# EAGLE board v7-flex2811_32x (EAGLE 7.3.0)
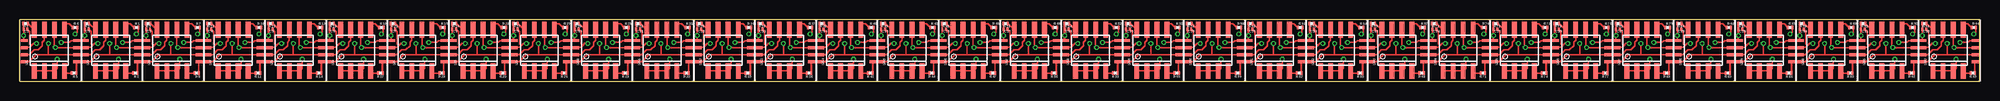
[diagram p32: board, top side]
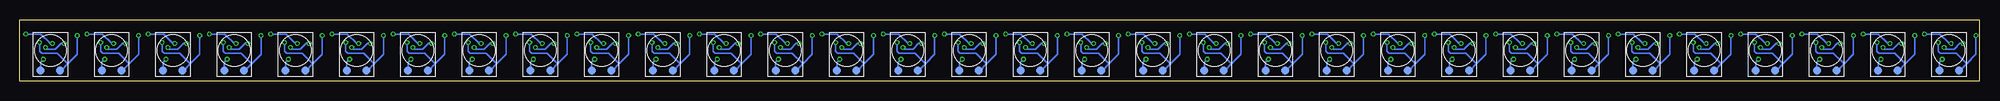
[diagram p33: board, bottom side, seen from below]

Size 248 x 7.75 mm. Coordinates in mm from the lower left corner, seen from the top.
Outline: 0,0 248,0 248,7.75 0,7.75 0,0
Copper layers (1*16): Top 0.035mm / dielectric 1.5mm / Bottom 0.035mm
Design rules "PCBWayMin": minimum track width 6mil, minimum drill 0.3mm, track to track 6mil, track to pad 6mil, pad to pad 6mil, via to via 6mil, smd to smd 0mil, copper to edge 10mil, drill to drill 8mil, minimum pad ring 10mil, minimum via ring 6mil, stop-mask expansion 4mil, vias tented up to drill 25mil, thermal gap 10mil

## Footprints (pad centres in the part's own frame; a part is rotated, then mirrored left to right if it is on the bottom)
C0201 = smd 0.25 x 0.35: 1 -0.25,0; 2 0.25,0
R0201 = smd 0.28 x 0.43: 1 -0.255,0; 2 0.255,0
SO08 = smd 0.6 x 2: 1 -1.905,-2.6; 2 -0.635,-2.6; 3 0.635,-2.6; 4 1.905,-2.6; 5 1.905,2.6; 6 0.635,2.6; 7 -0.635,2.6; 8 -1.905,2.6
TP_4MM_MED_PAD = smd 1.016 x 1.016: P$1 -1.24,-2.55; P$2 1.24,-2.55
4PAD = smd 1 x 0.4: P$1 0,0.3 | smd 1 x 0.35: P$2 0,1.2; P$3 0,2.1; P$4 0,3

## Placement (x,y rotation side)
C1  [C0201]  8.47,6.55 0 top
C2  [C0201]  0.72,6.55 0 top
C3  [C0201]  16.23,6.55 0 top
C4  [C0201]  23.98,6.55 0 top
C5  [C0201]  31.73,6.55 0 top
C6  [C0201]  39.48,6.55 0 top
C7  [C0201]  47.23,6.55 0 top
C8  [C0201]  54.98,6.55 0 top
C9  [C0201]  62.73,6.55 0 top
C10  [C0201]  70.47,6.55 0 top
C11  [C0201]  78.22,6.55 0 top
C12  [C0201]  85.97,6.55 0 top
C13  [C0201]  93.72,6.55 0 top
C14  [C0201]  101.47,6.55 0 top
C15  [C0201]  109.22,6.55 0 top
C16  [C0201]  116.97,6.55 0 top
C17  [C0201]  124.72,6.55 0 top
C18  [C0201]  132.47,6.55 0 top
C19  [C0201]  140.22,6.55 0 top
C20  [C0201]  147.97,6.55 0 top
C21  [C0201]  155.72,6.55 0 top
C22  [C0201]  163.47,6.55 0 top
C23  [C0201]  171.22,6.55 0 top
C24  [C0201]  178.97,6.55 0 top
C25  [C0201]  186.72,6.55 0 top
C26  [C0201]  194.47,6.55 0 top
C27  [C0201]  202.22,6.55 0 top
C28  [C0201]  209.97,6.55 0 top
C29  [C0201]  217.72,6.55 0 top
C30  [C0201]  225.47,6.55 0 top
C31  [C0201]  233.22,6.55 0 top
C32  [C0201]  240.97,6.55 0 top
R1  [R0201]  14.75,6.75 0 top
R2  [R0201]  14.62,1 180 top
R3  100  [R0201]  8.47,7.28 180 top
R4  [R0201]  7,6.75 0 top
R5  [R0201]  6.88,1 180 top
R6  100  [R0201]  0.72,7.28 180 top
R7  [R0201]  22.5,6.75 0 top
R8  [R0201]  22.38,1 180 top
R9  100  [R0201]  16.23,7.28 180 top
R10  [R0201]  30.25,6.75 0 top
R11  [R0201]  30.12,1 180 top
R12  100  [R0201]  23.98,7.28 180 top
R13  [R0201]  38,6.75 0 top
R14  [R0201]  37.88,1 180 top
R15  100  [R0201]  31.73,7.28 180 top
R16  [R0201]  45.75,6.75 0 top
R17  [R0201]  45.62,1 180 top
R18  100  [R0201]  39.48,7.28 180 top
R19  [R0201]  53.5,6.75 0 top
R20  [R0201]  53.38,1 180 top
R21  100  [R0201]  47.23,7.28 180 top
R22  [R0201]  61.25,6.75 0 top
R23  [R0201]  61.12,1 180 top
R24  100  [R0201]  54.98,7.28 180 top
R25  [R0201]  69,6.75 0 top
R26  [R0201]  68.88,1 180 top
R27  100  [R0201]  62.73,7.28 180 top
R28  [R0201]  76.75,6.75 0 top
R29  [R0201]  76.62,1 180 top
R30  100  [R0201]  70.47,7.28 180 top
R31  [R0201]  84.5,6.75 0 top
R32  [R0201]  84.38,1 180 top
R33  100  [R0201]  78.22,7.28 180 top
R34  [R0201]  92.25,6.75 0 top
R35  [R0201]  92.12,1 180 top
R36  100  [R0201]  85.97,7.28 180 top
R37  [R0201]  100,6.75 0 top
R38  [R0201]  99.88,1 180 top
R39  100  [R0201]  93.72,7.28 180 top
R40  [R0201]  107.75,6.75 0 top
R41  [R0201]  107.62,1 180 top
R42  100  [R0201]  101.47,7.28 180 top
R43  [R0201]  115.5,6.75 0 top
R44  [R0201]  115.38,1 180 top
R45  100  [R0201]  109.22,7.28 180 top
R46  [R0201]  123.25,6.75 0 top
R47  [R0201]  123.12,1 180 top
R48  100  [R0201]  116.97,7.28 180 top
R49  [R0201]  131,6.75 0 top
R50  [R0201]  130.88,1 180 top
R51  100  [R0201]  124.72,7.28 180 top
R52  [R0201]  138.75,6.75 0 top
R53  [R0201]  138.62,1 180 top
R54  100  [R0201]  132.47,7.28 180 top
R55  [R0201]  146.5,6.75 0 top
R56  [R0201]  146.38,1 180 top
R57  100  [R0201]  140.22,7.28 180 top
R58  [R0201]  154.25,6.75 0 top
R59  [R0201]  154.12,1 180 top
R60  100  [R0201]  147.97,7.28 180 top
R61  [R0201]  162,6.75 0 top
R62  [R0201]  161.88,1 180 top
R63  100  [R0201]  155.72,7.28 180 top
R64  [R0201]  169.75,6.75 0 top
R65  [R0201]  169.62,1 180 top
R66  100  [R0201]  163.47,7.28 180 top
R67  [R0201]  177.5,6.75 0 top
R68  [R0201]  177.38,1 180 top
R69  100  [R0201]  171.22,7.28 180 top
R70  [R0201]  185.25,6.75 0 top
R71  [R0201]  185.12,1 180 top
R72  100  [R0201]  178.97,7.28 180 top
R73  [R0201]  193,6.75 0 top
R74  [R0201]  192.88,1 180 top
R75  100  [R0201]  186.72,7.28 180 top
R76  [R0201]  200.75,6.75 0 top
R77  [R0201]  200.62,1 180 top
R78  100  [R0201]  194.47,7.28 180 top
R79  [R0201]  208.5,6.75 0 top
R80  [R0201]  208.38,1 180 top
R81  100  [R0201]  202.22,7.28 180 top
R82  [R0201]  216.25,6.75 0 top
R83  [R0201]  216.12,1 180 top
R84  100  [R0201]  209.97,7.28 180 top
R85  [R0201]  224,6.75 0 top
R86  [R0201]  223.88,1 180 top
R87  100  [R0201]  217.72,7.28 180 top
R88  [R0201]  231.75,6.75 0 top
R89  [R0201]  231.62,1 180 top
R90  100  [R0201]  225.47,7.28 180 top
R91  [R0201]  239.5,6.75 0 top
R92  [R0201]  239.38,1 180 top
R93  100  [R0201]  233.22,7.28 180 top
R94  [R0201]  247.25,6.75 0 top
R95  [R0201]  247.12,1 180 top
R96  100  [R0201]  240.97,7.28 180 top
U1  WS2818  [SO08]  3.75,3.88 0 top
U2  WS2818  [SO08]  11.5,3.88 0 top
U3  WS2818  [SO08]  19.25,3.88 0 top
U4  WS2818  [SO08]  27,3.88 0 top
U5  WS2818  [SO08]  34.75,3.88 0 top
U6  WS2818  [SO08]  42.5,3.88 0 top
U7  WS2818  [SO08]  50.25,3.88 0 top
U8  WS2818  [SO08]  58,3.88 0 top
U9  WS2818  [SO08]  65.75,3.88 0 top
U10  WS2818  [SO08]  73.5,3.88 0 top
U11  WS2818  [SO08]  81.25,3.88 0 top
U12  WS2818  [SO08]  89,3.88 0 top
U13  WS2818  [SO08]  96.75,3.88 0 top
U14  WS2818  [SO08]  104.5,3.88 0 top
U15  WS2818  [SO08]  112.25,3.88 0 top
U16  WS2818  [SO08]  120,3.88 0 top
U17  WS2818  [SO08]  127.75,3.88 0 top
U18  WS2818  [SO08]  135.5,3.88 0 top
U19  WS2818  [SO08]  143.25,3.88 0 top
U20  WS2818  [SO08]  151,3.88 0 top
U21  WS2818  [SO08]  158.75,3.88 0 top
U22  WS2818  [SO08]  166.5,3.88 0 top
U23  WS2818  [SO08]  174.25,3.88 0 top
U24  WS2818  [SO08]  182,3.88 0 top
U25  WS2818  [SO08]  189.75,3.88 0 top
U26  WS2818  [SO08]  197.5,3.88 0 top
U27  WS2818  [SO08]  205.25,3.88 0 top
U28  WS2818  [SO08]  213,3.88 0 top
U29  WS2818  [SO08]  220.75,3.88 0 top
U30  WS2818  [SO08]  228.5,3.88 0 top
U31  WS2818  [SO08]  236.25,3.88 0 top
U32  WS2818  [SO08]  244,3.88 0 top
U$1  TP_4MM_MED_PAD  [TP_4MM_MED_PAD]  3.88,3.88 0 bottom
U$3  4PAD  [4PAD]  0.5,2.12 0 top
U$4  4PAD  [4PAD]  7.25,2.12 0 top
U$5  TP_4MM_MED_PAD  [TP_4MM_MED_PAD]  11.62,3.88 0 bottom
U$7  4PAD  [4PAD]  8.25,2.12 0 top
U$8  4PAD  [4PAD]  15,2.12 0 top
U$9  TP_4MM_MED_PAD  [TP_4MM_MED_PAD]  19.38,3.88 0 bottom
U$11  4PAD  [4PAD]  16,2.12 0 top
U$12  4PAD  [4PAD]  22.75,2.12 0 top
U$13  TP_4MM_MED_PAD  [TP_4MM_MED_PAD]  27.12,3.88 0 bottom
U$15  4PAD  [4PAD]  23.75,2.12 0 top
U$16  4PAD  [4PAD]  30.5,2.12 0 top
U$17  TP_4MM_MED_PAD  [TP_4MM_MED_PAD]  34.88,3.88 0 bottom
U$19  4PAD  [4PAD]  31.5,2.12 0 top
U$20  4PAD  [4PAD]  38.25,2.12 0 top
U$21  TP_4MM_MED_PAD  [TP_4MM_MED_PAD]  42.62,3.88 0 bottom
U$23  4PAD  [4PAD]  39.25,2.12 0 top
U$24  4PAD  [4PAD]  46,2.12 0 top
U$25  TP_4MM_MED_PAD  [TP_4MM_MED_PAD]  50.38,3.88 0 bottom
U$27  4PAD  [4PAD]  47,2.12 0 top
U$28  4PAD  [4PAD]  53.75,2.12 0 top
U$29  TP_4MM_MED_PAD  [TP_4MM_MED_PAD]  58.12,3.88 0 bottom
U$31  4PAD  [4PAD]  54.75,2.12 0 top
U$32  4PAD  [4PAD]  61.5,2.12 0 top
U$33  TP_4MM_MED_PAD  [TP_4MM_MED_PAD]  65.88,3.88 0 bottom
U$35  4PAD  [4PAD]  62.5,2.12 0 top
U$36  4PAD  [4PAD]  69.25,2.12 0 top
U$37  TP_4MM_MED_PAD  [TP_4MM_MED_PAD]  73.62,3.88 0 bottom
U$39  4PAD  [4PAD]  70.25,2.12 0 top
U$40  4PAD  [4PAD]  77,2.12 0 top
U$41  TP_4MM_MED_PAD  [TP_4MM_MED_PAD]  81.38,3.88 0 bottom
U$43  4PAD  [4PAD]  78,2.12 0 top
U$44  4PAD  [4PAD]  84.75,2.12 0 top
U$45  TP_4MM_MED_PAD  [TP_4MM_MED_PAD]  89.12,3.88 0 bottom
U$47  4PAD  [4PAD]  85.75,2.12 0 top
U$48  4PAD  [4PAD]  92.5,2.12 0 top
U$49  TP_4MM_MED_PAD  [TP_4MM_MED_PAD]  96.88,3.88 0 bottom
U$51  4PAD  [4PAD]  93.5,2.12 0 top
U$52  4PAD  [4PAD]  100.25,2.12 0 top
U$53  TP_4MM_MED_PAD  [TP_4MM_MED_PAD]  104.62,3.88 0 bottom
U$55  4PAD  [4PAD]  101.25,2.12 0 top
U$56  4PAD  [4PAD]  108,2.12 0 top
U$57  TP_4MM_MED_PAD  [TP_4MM_MED_PAD]  112.38,3.88 0 bottom
U$59  4PAD  [4PAD]  109,2.12 0 top
U$60  4PAD  [4PAD]  115.75,2.12 0 top
U$61  TP_4MM_MED_PAD  [TP_4MM_MED_PAD]  120.12,3.88 0 bottom
U$63  4PAD  [4PAD]  116.75,2.12 0 top
U$64  4PAD  [4PAD]  123.5,2.12 0 top
U$65  TP_4MM_MED_PAD  [TP_4MM_MED_PAD]  127.88,3.88 0 bottom
U$67  4PAD  [4PAD]  124.5,2.12 0 top
U$68  4PAD  [4PAD]  131.25,2.12 0 top
U$69  TP_4MM_MED_PAD  [TP_4MM_MED_PAD]  135.62,3.88 0 bottom
U$71  4PAD  [4PAD]  132.25,2.12 0 top
U$72  4PAD  [4PAD]  139,2.12 0 top
U$73  TP_4MM_MED_PAD  [TP_4MM_MED_PAD]  143.38,3.88 0 bottom
U$75  4PAD  [4PAD]  140,2.12 0 top
U$76  4PAD  [4PAD]  146.75,2.12 0 top
U$77  TP_4MM_MED_PAD  [TP_4MM_MED_PAD]  151.12,3.88 0 bottom
U$79  4PAD  [4PAD]  147.75,2.12 0 top
U$80  4PAD  [4PAD]  154.5,2.12 0 top
U$81  TP_4MM_MED_PAD  [TP_4MM_MED_PAD]  158.88,3.88 0 bottom
U$83  4PAD  [4PAD]  155.5,2.12 0 top
U$84  4PAD  [4PAD]  162.25,2.12 0 top
U$85  TP_4MM_MED_PAD  [TP_4MM_MED_PAD]  166.62,3.88 0 bottom
U$87  4PAD  [4PAD]  163.25,2.12 0 top
U$88  4PAD  [4PAD]  170,2.12 0 top
U$89  TP_4MM_MED_PAD  [TP_4MM_MED_PAD]  174.38,3.88 0 bottom
U$91  4PAD  [4PAD]  171,2.12 0 top
U$92  4PAD  [4PAD]  177.75,2.12 0 top
U$93  TP_4MM_MED_PAD  [TP_4MM_MED_PAD]  182.12,3.88 0 bottom
U$95  4PAD  [4PAD]  178.75,2.12 0 top
U$96  4PAD  [4PAD]  185.5,2.12 0 top
U$97  TP_4MM_MED_PAD  [TP_4MM_MED_PAD]  189.88,3.88 0 bottom
U$99  4PAD  [4PAD]  186.5,2.12 0 top
U$100  4PAD  [4PAD]  193.25,2.12 0 top
U$101  TP_4MM_MED_PAD  [TP_4MM_MED_PAD]  197.62,3.88 0 bottom
U$103  4PAD  [4PAD]  194.25,2.12 0 top
U$104  4PAD  [4PAD]  201,2.12 0 top
U$105  TP_4MM_MED_PAD  [TP_4MM_MED_PAD]  205.38,3.88 0 bottom
U$107  4PAD  [4PAD]  202,2.12 0 top
U$108  4PAD  [4PAD]  208.75,2.12 0 top
U$109  TP_4MM_MED_PAD  [TP_4MM_MED_PAD]  213.12,3.88 0 bottom
U$111  4PAD  [4PAD]  209.75,2.12 0 top
U$112  4PAD  [4PAD]  216.5,2.12 0 top
U$113  TP_4MM_MED_PAD  [TP_4MM_MED_PAD]  220.88,3.88 0 bottom
U$115  4PAD  [4PAD]  217.5,2.12 0 top
U$116  4PAD  [4PAD]  224.25,2.12 0 top
U$117  TP_4MM_MED_PAD  [TP_4MM_MED_PAD]  228.62,3.88 0 bottom
U$119  4PAD  [4PAD]  225.25,2.12 0 top
U$120  4PAD  [4PAD]  232,2.12 0 top
U$121  TP_4MM_MED_PAD  [TP_4MM_MED_PAD]  236.38,3.88 0 bottom
U$123  4PAD  [4PAD]  233,2.12 0 top
U$124  4PAD  [4PAD]  239.75,2.12 0 top
U$125  TP_4MM_MED_PAD  [TP_4MM_MED_PAD]  244.12,3.88 0 bottom
U$127  4PAD  [4PAD]  240.75,2.12 0 top
U$128  4PAD  [4PAD]  247.5,2.12 0 top

## Tracks (layer width: path | path; a pad name or v marks a point on that pad's centre or on a via)
BIN0
  Top 0.2: U$3.P$2 1.2,3.33 1.8,3.93 2.35,3.93 2.87,4.45 2.87,4.89 3.12,5.13 U1.7
DIN0  (via drill 0.3)
  Top 0.2: 3.62,3.33 v3.62,4.75 | R4.2 7.25,6.2 v7,5.94 | U$3.P$1 1.17,2.42 2.06,3.33 3.62,3.33 | 3.62,3.33 U$4.P$2 | U$7.P$2 8.95,3.33 9.55,3.93 10.1,3.93 10.62,4.45 10.62,4.89 10.87,5.13 U2.7
  Top 0.254: U$7.P$2 U$4.P$2
  Bottom 0.2: v3.62,4.75 3.88,4.75 5.07,5.94 v7,5.94
DOUT0  (via drill 0.3)
  Top 0.2: R5.1 7.13,2.31 U$4.P$1 | 11.38,3.33 v11.38,4.75 | R1.2 15.01,6.2 v14.75,5.94 | U$7.P$1 8.91,2.42 9.81,3.33 11.38,3.33 | 11.38,3.33 U$8.P$2 | U$11.P$2 16.7,3.33 17.3,3.93 17.85,3.93 18.37,4.45 18.37,4.89 18.61,5.13 U3.7 18.62,6.46
  Top 0.254: U$7.P$1 7.13,2.42 R5.1 | U$11.P$2 U$8.P$2
  Bottom 0.2: v11.38,4.75 11.62,4.75 12.81,5.94 v14.75,5.94
DOUT1  (via drill 0.3)
  Top 0.2: R2.1 14.88,2.31 U$8.P$1 | 19.12,3.33 v19.12,4.75 | R7.2 22.75,6.2 v22.5,5.94 | U$11.P$1 16.66,2.42 17.57,3.33 19.12,3.33 | 19.12,3.33 U$12.P$2 | U$15.P$2 24.45,3.33 25.05,3.93 25.6,3.93 26.12,4.45 26.12,4.89 26.36,5.13 U4.7 26.38,6.46
  Top 0.254: U$11.P$1 14.88,2.42 R2.1 | U$15.P$2 U$12.P$2
  Bottom 0.2: v19.12,4.75 19.38,4.75 20.57,5.94 v22.5,5.94
DOUT2  (via drill 0.3)
  Top 0.2: R8.1 22.63,2.31 U$12.P$1 | 26.88,3.33 v26.88,4.75 | R10.2 30.5,6.2 v30.25,5.94 | U$15.P$1 24.41,2.42 25.32,3.33 26.88,3.33 | 26.88,3.33 U$16.P$2 | U$19.P$2 32.2,3.33 32.8,3.93 33.35,3.93 33.87,4.45 33.87,4.89 34.12,5.13 U5.7
  Top 0.254: U$12.P$1 U$15.P$1 | U$16.P$2 U$19.P$2
  Bottom 0.2: v26.88,4.75 27.12,4.75 28.32,5.94 v30.25,5.94
DOUT3  (via drill 0.3)
  Top 0.2: R11.1 30.38,2.31 U$16.P$1 | 34.62,3.33 v34.62,4.75 | R13.2 38.26,6.2 v38,5.94 | U$19.P$1 32.16,2.42 33.06,3.33 34.62,3.33 | 34.62,3.33 U$20.P$2 | U$23.P$2 39.95,3.33 40.55,3.93 41.1,3.93 41.62,4.45 41.62,4.89 41.87,5.13 U6.7
  Top 0.254: U$23.P$2 U$20.P$2 | U$19.P$1 30.38,2.42 R11.1
  Bottom 0.2: v34.62,4.75 34.88,4.75 36.06,5.94 v38,5.94
DOUT4  (via drill 0.3)
  Top 0.2: R14.1 38.13,2.31 U$20.P$1 | 42.38,3.33 v42.38,4.75 | R16.2 46.01,6.2 v45.75,5.94 | U$23.P$1 39.91,2.42 40.81,3.33 42.38,3.33 | 42.38,3.33 U$24.P$2 | U$27.P$2 47.7,3.33 48.3,3.93 48.85,3.93 49.37,4.45 49.37,4.89 49.62,5.13 U7.7
  Top 0.254: U$23.P$1 38.13,2.42 R14.1 | U$27.P$2 U$24.P$2
  Bottom 0.2: v42.38,4.75 42.62,4.75 43.81,5.94 v45.75,5.94
DOUT5  (via drill 0.3)
  Top 0.2: R17.1 45.88,2.31 U$24.P$1 | 50.12,3.33 v50.12,4.75 | R19.2 53.76,6.2 v53.5,5.94 | U$27.P$1 47.66,2.42 48.56,3.33 50.12,3.33 | 50.12,3.33 U$28.P$2 | U$31.P$2 55.45,3.33 56.05,3.93 56.6,3.93 57.12,4.45 57.12,4.89 57.37,5.13 U8.7
  Top 0.254: U$27.P$1 45.88,2.42 R17.1 | U$31.P$2 U$28.P$2
  Bottom 0.2: v50.12,4.75 50.38,4.75 51.56,5.94 v53.5,5.94
DOUT6  (via drill 0.3)
  Top 0.2: R20.1 53.63,2.31 U$28.P$1 | 57.88,3.33 v57.88,4.75 | R22.2 61.51,6.2 v61.25,5.94 | U$31.P$1 55.41,2.42 56.31,3.33 57.88,3.33 | 57.88,3.33 U$32.P$2 | U$35.P$2 63.2,3.33 63.8,3.93 64.35,3.93 64.87,4.45 64.87,4.89 65.11,5.13 U9.7 65.12,6.46
  Top 0.254: U$28.P$1 U$31.P$1 | U$32.P$2 U$35.P$2
  Bottom 0.2: v57.88,4.75 58.12,4.75 59.31,5.94 v61.25,5.94
DOUT7  (via drill 0.3)
  Top 0.2: R23.1 61.38,2.31 U$32.P$1 | 65.62,3.33 v65.62,4.75 | R25.2 69.25,6.2 v69,5.94 | U$35.P$1 63.16,2.42 64.06,3.33 65.62,3.33 | 65.62,3.33 U$36.P$2 | U$39.P$2 70.95,3.33 71.56,3.93 72.1,3.93 72.62,4.45 72.62,4.89 72.86,5.13 U10.7 72.88,6.46
  Top 0.254: U$39.P$2 U$36.P$2 | U$32.P$1 U$35.P$1
  Bottom 0.2: v65.62,4.75 65.88,4.75 67.06,5.94 v69,5.94
DOUT8  (via drill 0.3)
  Top 0.2: R26.1 69.13,2.31 U$36.P$1 | 73.38,3.33 v73.38,4.75 | R28.2 77,6.2 v76.75,5.94 | U$39.P$1 70.92,2.42 71.81,3.33 73.38,3.33 | 73.38,3.33 U$40.P$2 | U$43.P$2 78.7,3.33 79.31,3.93 79.85,3.93 80.37,4.45 80.37,4.89 80.61,5.13 U11.7 80.62,6.46
  Top 0.254: U$39.P$1 69.13,2.42 R26.1 | U$43.P$2 U$40.P$2
  Bottom 0.2: v73.38,4.75 73.62,4.75 74.81,5.94 v76.75,5.94
DOUT9  (via drill 0.3)
  Top 0.2: R29.1 76.88,2.31 U$40.P$1 | 81.12,3.33 v81.12,4.75 | R31.2 84.75,6.2 v84.5,5.94 | U$43.P$1 78.67,2.42 79.56,3.33 81.12,3.33 | 81.12,3.33 U$44.P$2 | U$47.P$2 86.45,3.33 87.06,3.93 87.6,3.93 88.12,4.45 88.12,4.89 88.36,5.13 U12.7 88.38,6.46
  Top 0.254: U$43.P$1 76.88,2.42 R29.1 | U$47.P$2 U$44.P$2
  Bottom 0.2: v81.12,4.75 81.38,4.75 82.56,5.94 v84.5,5.94
DOUT10  (via drill 0.3)
  Top 0.2: R32.1 84.63,2.31 U$44.P$1 | 88.88,3.33 v88.88,4.75 | R34.2 92.5,6.2 v92.25,5.94 | U$47.P$1 86.42,2.42 87.31,3.33 88.88,3.33 | 88.88,3.33 U$48.P$2 | U$51.P$2 94.2,3.33 94.81,3.93 95.35,3.93 95.87,4.45 95.87,4.89 96.11,5.13 U13.7 96.12,6.46
  Top 0.254: U$44.P$1 U$47.P$1 | U$48.P$2 U$51.P$2
  Bottom 0.2: v88.88,4.75 89.12,4.75 90.31,5.94 v92.25,5.94
DOUT11  (via drill 0.3)
  Top 0.2: R35.1 92.38,2.31 U$48.P$1 | 96.62,3.33 v96.62,4.75 | R37.2 100.25,6.2 v100,5.94 | U$51.P$1 94.17,2.42 95.06,3.33 96.62,3.33 | 96.62,3.33 U$52.P$2 | U$55.P$2 101.95,3.33 102.56,3.93 103.1,3.93 103.62,4.45 103.62,4.89 103.86,5.13 U14.7 103.88,6.46
  Top 0.254: U$55.P$2 U$52.P$2 | U$51.P$1 92.38,2.42 R35.1
  Bottom 0.2: v96.62,4.75 96.88,4.75 98.06,5.94 v100,5.94
DOUT12  (via drill 0.3)
  Top 0.2: R38.1 100.13,2.31 U$52.P$1 | 104.38,3.33 v104.38,4.75 | R40.2 108,6.2 v107.75,5.94 | U$55.P$1 101.92,2.42 102.81,3.33 104.38,3.33 | 104.38,3.33 U$56.P$2 | U$59.P$2 109.7,3.33 110.31,3.93 110.85,3.93 111.37,4.45 111.37,4.89 111.61,5.13 U15.7 111.62,6.46
  Top 0.254: U$55.P$1 100.13,2.42 R38.1 | U$59.P$2 U$56.P$2
  Bottom 0.2: v104.38,4.75 104.62,4.75 105.81,5.94 v107.75,5.94
DOUT13  (via drill 0.3)
  Top 0.2: R41.1 107.88,2.31 U$56.P$1 | 112.12,3.33 v112.12,4.75 | R43.2 115.75,6.2 v115.5,5.94 | U$59.P$1 109.67,2.42 110.56,3.33 112.12,3.33 | 112.12,3.33 U$60.P$2 | U$63.P$2 117.45,3.33 118.06,3.93 118.6,3.93 119.12,4.45 119.12,4.89 119.36,5.13 U16.7 119.38,6.46
  Top 0.254: U$59.P$1 107.88,2.42 R41.1 | U$63.P$2 U$60.P$2
  Bottom 0.2: v112.12,4.75 112.38,4.75 113.56,5.94 v115.5,5.94
DOUT14  (via drill 0.3)
  Top 0.2: R44.1 115.63,2.31 U$60.P$1 | 119.88,3.33 v119.88,4.75 | R46.2 123.5,6.2 v123.25,5.94 | U$63.P$1 117.42,2.42 118.31,3.33 119.88,3.33 | 119.88,3.33 U$64.P$2 | U$67.P$2 125.2,3.33 125.81,3.93 126.35,3.93 126.87,4.45 126.87,4.89 127.11,5.13 U17.7 127.12,6.46
  Top 0.254: U$60.P$1 U$63.P$1 | U$67.P$2 U$64.P$2
  Bottom 0.2: v119.88,4.75 120.12,4.75 121.31,5.94 v123.25,5.94
DOUT15  (via drill 0.3)
  Top 0.2: R47.1 123.38,2.31 U$64.P$1 | 127.62,3.33 v127.62,4.75 | R49.2 131.25,6.2 v131,5.94 | U$67.P$1 125.17,2.42 126.06,3.33 127.62,3.33 | 127.62,3.33 U$68.P$2 | U$71.P$2 132.95,3.33 133.56,3.93 134.1,3.93 134.62,4.45 134.62,4.89 134.87,5.13 U18.7
  Top 0.254: U$71.P$2 U$68.P$2 | U$64.P$1 U$67.P$1
  Bottom 0.2: v127.62,4.75 127.88,4.75 129.06,5.94 v131,5.94
DOUT16  (via drill 0.3)
  Top 0.2: R50.1 131.13,2.31 U$68.P$1 | 135.38,3.33 v135.38,4.75 | R52.2 139,6.2 v138.75,5.94 | U$71.P$1 132.91,2.42 133.81,3.33 135.38,3.33 | 135.38,3.33 U$72.P$2 | U$75.P$2 140.7,3.33 141.31,3.93 141.85,3.93 142.37,4.45 142.37,4.89 142.62,5.13 U19.7
  Top 0.254: U$71.P$1 131.13,2.42 R50.1 | U$75.P$2 U$72.P$2
  Bottom 0.2: v135.38,4.75 135.62,4.75 136.81,5.94 v138.75,5.94
DOUT17  (via drill 0.3)
  Top 0.2: R53.1 138.88,2.31 U$72.P$1 | 143.12,3.33 v143.12,4.75 | R55.2 146.75,6.2 v146.5,5.94 | U$75.P$1 140.66,2.42 141.56,3.33 143.12,3.33 | 143.12,3.33 U$76.P$2 | U$79.P$2 148.45,3.33 149.06,3.93 149.6,3.93 150.12,4.45 150.12,4.89 150.37,5.13 U20.7
  Top 0.254: U$75.P$1 138.88,2.42 R53.1 | U$79.P$2 U$76.P$2
  Bottom 0.2: v143.12,4.75 143.38,4.75 144.56,5.94 v146.5,5.94
DOUT18  (via drill 0.3)
  Top 0.2: R56.1 146.63,2.31 U$76.P$1 | 150.88,3.33 v150.88,4.75 | R58.2 154.5,6.2 v154.25,5.94 | U$79.P$1 148.41,2.42 149.31,3.33 150.88,3.33 | 150.88,3.33 U$80.P$2 | U$83.P$2 156.2,3.33 156.81,3.93 157.35,3.93 157.87,4.45 157.87,4.89 158.12,5.13 U21.7
  Top 0.254: U$76.P$1 U$79.P$1 | U$80.P$2 U$83.P$2
  Bottom 0.2: v150.88,4.75 151.12,4.75 152.31,5.94 v154.25,5.94
DOUT19  (via drill 0.3)
  Top 0.2: R59.1 154.38,2.31 U$80.P$1 | 158.62,3.33 v158.62,4.75 | R61.2 162.25,6.2 v162,5.94 | U$83.P$1 156.16,2.42 157.06,3.33 158.62,3.33 | 158.62,3.33 U$84.P$2 | U$87.P$2 163.95,3.33 164.56,3.93 165.1,3.93 165.62,4.45 165.62,4.89 165.87,5.13 U22.7
  Top 0.254: U$87.P$2 U$84.P$2 | U$83.P$1 154.38,2.42 R59.1
  Bottom 0.2: v158.62,4.75 158.88,4.75 160.06,5.94 v162,5.94
DOUT20  (via drill 0.3)
  Top 0.2: R62.1 162.13,2.31 U$84.P$1 | 166.38,3.33 v166.38,4.75 | R64.2 170,6.2 v169.75,5.94 | U$87.P$1 163.91,2.42 164.81,3.33 166.38,3.33 | 166.38,3.33 U$88.P$2 | U$91.P$2 171.7,3.33 172.31,3.93 172.85,3.93 173.37,4.45 173.37,4.89 173.62,5.13 U23.7
  Top 0.254: U$87.P$1 162.13,2.42 R62.1 | U$91.P$2 U$88.P$2
  Bottom 0.2: v166.38,4.75 166.62,4.75 167.81,5.94 v169.75,5.94
DOUT21  (via drill 0.3)
  Top 0.2: R65.1 169.88,2.31 U$88.P$1 | 174.12,3.33 v174.12,4.75 | R67.2 177.75,6.2 v177.5,5.94 | U$91.P$1 171.66,2.42 172.56,3.33 174.12,3.33 | 174.12,3.33 U$92.P$2 | U$95.P$2 179.45,3.33 180.06,3.93 180.6,3.93 181.12,4.45 181.12,4.89 181.37,5.13 U24.7
  Top 0.254: U$91.P$1 169.88,2.42 R65.1 | U$95.P$2 U$92.P$2
  Bottom 0.2: v174.12,4.75 174.38,4.75 175.56,5.94 v177.5,5.94
DOUT22  (via drill 0.3)
  Top 0.2: R68.1 177.63,2.31 U$92.P$1 | 181.88,3.33 v181.88,4.75 | R70.2 185.5,6.2 v185.25,5.94 | U$95.P$1 179.41,2.42 180.31,3.33 181.88,3.33 | 181.88,3.33 U$96.P$2 | U$99.P$2 187.2,3.33 187.81,3.93 188.35,3.93 188.87,4.45 188.87,4.89 189.12,5.13 U25.7
  Top 0.254: U$92.P$1 U$95.P$1 | U$96.P$2 U$99.P$2
  Bottom 0.2: v181.88,4.75 182.12,4.75 183.31,5.94 v185.25,5.94
DOUT23  (via drill 0.3)
  Top 0.2: R71.1 185.38,2.31 U$96.P$1 | 189.62,3.33 v189.62,4.75 | R73.2 193.25,6.2 v193,5.94 | U$99.P$1 187.16,2.42 188.06,3.33 189.62,3.33 | 189.62,3.33 U$100.P$2 | U$103.P$2 194.95,3.33 195.56,3.93 196.1,3.93 196.62,4.45 196.62,4.89 196.87,5.13 U26.7
  Top 0.254: U$103.P$2 U$100.P$2 | U$96.P$1 U$99.P$1
  Bottom 0.2: v189.62,4.75 189.88,4.75 191.06,5.94 v193,5.94
DOUT24  (via drill 0.3)
  Top 0.2: R74.1 193.13,2.31 U$100.P$1 | 197.38,3.33 v197.38,4.75 | R76.2 201,6.2 v200.75,5.94 | U$103.P$1 194.91,2.42 195.81,3.33 197.38,3.33 | 197.38,3.33 U$104.P$2 | U$107.P$2 202.7,3.33 203.31,3.93 203.85,3.93 204.37,4.45 204.37,4.89 204.62,5.13 U27.7
  Top 0.254: U$103.P$1 193.13,2.42 R74.1 | U$107.P$2 U$104.P$2
  Bottom 0.2: v197.38,4.75 197.62,4.75 198.81,5.94 v200.75,5.94
DOUT25  (via drill 0.3)
  Top 0.2: R77.1 200.88,2.31 U$104.P$1 | 205.12,3.33 v205.12,4.75 | R79.2 208.75,6.2 v208.5,5.94 | U$107.P$1 202.66,2.42 203.56,3.33 205.12,3.33 | 205.12,3.33 U$108.P$2 | U$111.P$2 210.45,3.33 211.06,3.93 211.6,3.93 212.12,4.45 212.12,4.89 212.37,5.13 U28.7
  Top 0.254: U$107.P$1 200.88,2.42 R77.1 | U$111.P$2 U$108.P$2
  Bottom 0.2: v205.12,4.75 205.38,4.75 206.56,5.94 v208.5,5.94
DOUT26  (via drill 0.3)
  Top 0.2: R80.1 208.63,2.31 U$108.P$1 | 212.88,3.33 v212.88,4.75 | R82.2 216.5,6.2 v216.25,5.94 | U$111.P$1 210.41,2.42 211.31,3.33 212.88,3.33 | 212.88,3.33 U$112.P$2 | U$115.P$2 218.2,3.33 218.81,3.93 219.35,3.93 219.87,4.45 219.87,4.89 220.12,5.13 U29.7
  Top 0.254: U$108.P$1 U$111.P$1 | U$112.P$2 U$115.P$2
  Bottom 0.2: v212.88,4.75 213.12,4.75 214.31,5.94 v216.25,5.94
DOUT27  (via drill 0.3)
  Top 0.2: R83.1 216.38,2.31 U$112.P$1 | 220.62,3.33 v220.62,4.75 | R85.2 224.25,6.2 v224,5.94 | U$115.P$1 218.16,2.42 219.06,3.33 220.62,3.33 | 220.62,3.33 U$116.P$2 | U$119.P$2 225.95,3.33 226.56,3.93 227.1,3.93 227.62,4.45 227.62,4.89 227.87,5.13 U30.7
  Top 0.254: U$119.P$2 U$116.P$2 | U$115.P$1 216.38,2.42 R83.1
  Bottom 0.2: v220.62,4.75 220.88,4.75 222.06,5.94 v224,5.94
DOUT28  (via drill 0.3)
  Top 0.2: R86.1 224.13,2.31 U$116.P$1 | 228.38,3.33 v228.38,4.75 | R88.2 232,6.2 v231.75,5.94 | U$119.P$1 225.91,2.42 226.81,3.33 228.38,3.33 | 228.38,3.33 U$120.P$2 | U$123.P$2 233.7,3.33 234.31,3.93 234.85,3.93 235.37,4.45 235.37,4.89 235.62,5.13 U31.7
  Top 0.254: U$119.P$1 224.13,2.42 R86.1 | U$123.P$2 U$120.P$2
  Bottom 0.2: v228.38,4.75 228.62,4.75 229.81,5.94 v231.75,5.94
DOUT29  (via drill 0.3)
  Top 0.2: R89.1 231.88,2.31 U$120.P$1 | 236.12,3.33 v236.12,4.75 | R91.2 239.75,6.2 v239.5,5.94 | U$123.P$1 233.66,2.42 234.56,3.33 236.12,3.33 | 236.12,3.33 U$124.P$2 | U$127.P$2 241.45,3.33 242.06,3.93 242.6,3.93 243.12,4.45 243.12,4.89 243.37,5.13 U32.7
  Top 0.254: U$123.P$1 231.88,2.42 R89.1 | U$127.P$2 U$124.P$2
  Bottom 0.2: v236.12,4.75 236.38,4.75 237.56,5.94 v239.5,5.94
DOUT30  (via drill 0.3)
  Top 0.2: R92.1 239.63,2.31 U$124.P$1 | 243.88,3.33 v243.88,4.75 | R94.2 247.5,6.2 v247.25,5.94 | U$127.P$1 241.41,2.42 242.31,3.33 243.88,3.33 | 243.88,3.33 U$128.P$2
  Top 0.254: U$124.P$1 U$127.P$1
  Bottom 0.2: v243.88,4.75 244.12,4.75 245.31,5.94 v247.25,5.94
DOUT31
  Top 0.2: R95.1 247.38,2.31 U$128.P$1
GND  (via drill 0.3)
  Top 0.2: U1.6 4.38,4.37 v4.5,4.25 4.53,4.22 U$4.P$3 7.22,4.25 | U$3.P$3 0.85,4.22 0.88,4.25 1.25,4.25 1.5,4.5 | 1.5,4.5 1.75,4.75 v2.12,4.75 | 1.5,4.5 1.27,4.73 1.27,6.25 C2.2 | U2.6 12.13,4.37 v12.25,4.25 12.28,4.22 U$8.P$3 14.97,4.25 | U$7.P$3 8.6,4.22 8.62,4.25 9,4.25 9.25,4.5 | 9.25,4.5 9.5,4.75 v9.88,4.75 | 9.25,4.5 9.02,4.73 9.02,6.25 C1.2 | U3.6 19.89,4.37 v20,4.25 20.02,4.22 U$12.P$3 22.73,4.25 | U$11.P$3 16.35,4.22 16.38,4.25 16.75,4.25 17,4.5 | 17,4.5 17.25,4.75 v17.62,4.75 | 17,4.5 16.77,4.73 16.77,6.25 C3.2 | U4.6 27.64,4.37 v27.75,4.25 27.77,4.22 U$16.P$3 30.48,4.25 | U$15.P$3 24.1,4.22 24.12,4.25 24.5,4.25 24.75,4.5 | 24.75,4.5 25,4.75 v25.38,4.75 | 24.75,4.5 24.52,4.73 24.52,6.25 C4.2 | U5.6 35.38,4.37 v35.5,4.25 35.52,4.22 U$20.P$3 38.23,4.25 | U$19.P$3 31.85,4.22 31.88,4.25 32.25,4.25 32.5,4.5 | 32.5,4.5 32.75,4.75 v33.12,4.75 | 32.5,4.5 32.27,4.73 32.27,6.25 C5.2 | U6.6 43.13,4.37 v43.25,4.25 43.27,4.22 U$24.P$3 45.98,4.25 | U$23.P$3 39.6,4.22 39.62,4.25 40,4.25 40.25,4.5 | 40.25,4.5 40.5,4.75 v40.88,4.75 | 40.25,4.5 40.02,4.73 40.02,6.25 C6.2 | U7.6 50.88,4.37 v51,4.25 51.02,4.22 U$28.P$3 53.73,4.25 | U$27.P$3 47.35,4.22 47.38,4.25 47.75,4.25 48,4.5 | 48,4.5 48.25,4.75 v48.62,4.75 | 48,4.5 47.77,4.73 47.77,6.25 C7.2 | U8.6 58.63,4.37 v58.75,4.25 58.77,4.22 U$32.P$3 61.48,4.25 | U$31.P$3 55.1,4.22 55.12,4.25 55.5,4.25 55.75,4.5 | 55.75,4.5 56,4.75 v56.38,4.75 | 55.75,4.5 55.52,4.73 55.52,6.25 C8.2 | U9.6 66.39,4.37 v66.5,4.25 66.53,4.22 U$36.P$3 69.22,4.25 | U$35.P$3 62.85,4.22 62.88,4.25 63.25,4.25 63.5,4.5 | 63.5,4.5 63.75,4.75 v64.12,4.75 | 63.5,4.5 63.27,4.73 63.27,6.25 C9.2
  Top 0.2: U10.6 74.14,4.37 v74.25,4.25 74.28,4.22 U$40.P$3 76.97,4.25 | U$39.P$3 70.6,4.22 70.62,4.25 71,4.25 71.25,4.5 | 71.25,4.5 71.5,4.75 v71.88,4.75 | 71.25,4.5 71.02,4.73 71.02,6.25 C10.2 | U11.6 81.89,4.37 v82,4.25 82.03,4.22 U$44.P$3 84.72,4.25 | U$43.P$3 78.35,4.22 78.38,4.25 78.75,4.25 79,4.5 | 79,4.5 79.25,4.75 v79.62,4.75 | 79,4.5 78.77,4.73 78.77,6.25 C11.2 | U12.6 89.64,4.37 v89.75,4.25 89.78,4.22 U$48.P$3 92.47,4.25 | U$47.P$3 86.1,4.22 86.12,4.25 86.5,4.25 86.75,4.5 | 86.75,4.5 87,4.75 v87.38,4.75 | 86.75,4.5 86.52,4.73 86.52,6.25 C12.2 | U13.6 97.39,4.37 v97.5,4.25 97.53,4.22 U$52.P$3 100.22,4.25 | 93.85,4.22 93.88,4.25 94.25,4.25 94.5,4.5 | 94.5,4.5 94.75,4.75 v95.12,4.75 | 94.5,4.5 94.27,4.73 94.27,6.25 C13.2 | U14.6 105.14,4.37 v105.25,4.25 105.28,4.22 U$56.P$3 107.97,4.25 | U$55.P$3 101.6,4.22 101.62,4.25 102,4.25 102.25,4.5 | 102.25,4.5 102.5,4.75 v102.88,4.75 | 102.25,4.5 102.02,4.73 102.02,6.25 C14.2 | U15.6 112.89,4.37 v113,4.25 113.03,4.22 U$60.P$3 115.72,4.25 | U$59.P$3 109.35,4.22 109.38,4.25 109.75,4.25 110,4.5 | 110,4.5 110.25,4.75 v110.62,4.75 | 110,4.5 109.77,4.73 109.77,6.25 C15.2 | U16.6 120.64,4.37 v120.75,4.25 120.78,4.22 U$64.P$3 123.47,4.25 | U$63.P$3 117.1,4.22 117.12,4.25 117.5,4.25 117.75,4.5 | 117.75,4.5 118,4.75 v118.38,4.75 | 117.75,4.5 117.52,4.73 117.52,6.25 C16.2 | U17.6 128.38,4.37 v128.5,4.25 128.53,4.22 U$68.P$3 131.22,4.25 | U$67.P$3 124.85,4.22 124.88,4.25 125.25,4.25 125.5,4.5 | 125.5,4.5 125.75,4.75 v126.12,4.75 | 125.5,4.5 125.27,4.73 125.27,6.25 C17.2 | U18.6 136.13,4.37 v136.25,4.25 136.28,4.22 U$72.P$3 138.97,4.25 | U$71.P$3 132.6,4.22 132.62,4.25 133,4.25 133.25,4.5
  Top 0.2: 133.25,4.5 133.5,4.75 v133.88,4.75 | 133.25,4.5 133.02,4.73 133.02,6.25 C18.2 | U19.6 143.88,4.37 v144,4.25 144.03,4.22 U$76.P$3 146.72,4.25 | U$75.P$3 140.35,4.22 140.38,4.25 140.75,4.25 141,4.5 | 141,4.5 141.25,4.75 v141.62,4.75 | 141,4.5 140.77,4.73 140.77,6.25 C19.2 | U20.6 151.63,4.37 v151.75,4.25 151.78,4.22 U$80.P$3 154.47,4.25 | U$79.P$3 148.1,4.22 148.12,4.25 148.5,4.25 148.75,4.5 | 148.75,4.5 149,4.75 v149.38,4.75 | 148.75,4.5 148.52,4.73 148.52,6.25 C20.2 | U21.6 159.38,4.37 v159.5,4.25 159.53,4.22 U$84.P$3 162.22,4.25 | U$83.P$3 155.85,4.22 155.88,4.25 156.25,4.25 156.5,4.5 | 156.5,4.5 156.75,4.75 v157.12,4.75 | 156.5,4.5 156.27,4.73 156.27,6.25 C21.2 | U22.6 167.13,4.37 v167.25,4.25 167.28,4.22 U$88.P$3 169.97,4.25 | U$87.P$3 163.6,4.22 163.62,4.25 164,4.25 164.25,4.5 | 164.25,4.5 164.5,4.75 v164.88,4.75 | 164.25,4.5 164.02,4.73 164.02,6.25 C22.2 | U23.6 174.88,4.37 v175,4.25 175.03,4.22 U$92.P$3 177.72,4.25 | U$91.P$3 171.35,4.22 171.38,4.25 171.75,4.25 172,4.5 | 172,4.5 172.25,4.75 v172.62,4.75 | 172,4.5 171.77,4.73 171.77,6.25 C23.2 | U24.6 182.63,4.37 v182.75,4.25 182.78,4.22 U$96.P$3 185.47,4.25 | U$95.P$3 179.1,4.22 179.12,4.25 179.5,4.25 179.75,4.5 | 179.75,4.5 180,4.75 v180.38,4.75 | 179.75,4.5 179.52,4.73 179.52,6.25 C24.2 | U25.6 190.38,4.37 v190.5,4.25 190.53,4.22 U$100.P$3 193.22,4.25 | U$99.P$3 186.85,4.22 186.88,4.25 187.25,4.25 187.5,4.5 | 187.5,4.5 187.75,4.75 v188.12,4.75 | 187.5,4.5 187.27,4.73 187.27,6.25 C25.2 | U26.6 198.13,4.37 v198.25,4.25 198.28,4.22 U$104.P$3 200.97,4.25 | U$103.P$3 194.6,4.22 194.62,4.25 195,4.25 195.25,4.5 | 195.25,4.5 195.5,4.75 v195.88,4.75
  Top 0.2: 195.25,4.5 195.02,4.73 195.02,6.25 C26.2 | U27.6 205.88,4.37 v206,4.25 206.03,4.22 U$108.P$3 208.72,4.25 | U$107.P$3 202.35,4.22 202.38,4.25 202.75,4.25 203,4.5 | 203,4.5 203.25,4.75 v203.62,4.75 | 203,4.5 202.77,4.73 202.77,6.25 C27.2 | U28.6 213.63,4.37 v213.75,4.25 213.78,4.22 U$112.P$3 216.47,4.25 | U$111.P$3 210.1,4.22 210.12,4.25 210.5,4.25 210.75,4.5 | 210.75,4.5 211,4.75 v211.38,4.75 | 210.75,4.5 210.52,4.73 210.52,6.25 C28.2 | U29.6 221.38,4.37 v221.5,4.25 221.53,4.22 U$116.P$3 224.22,4.25 | U$115.P$3 217.85,4.22 217.88,4.25 218.25,4.25 218.5,4.5 | 218.5,4.5 218.75,4.75 v219.12,4.75 | 218.5,4.5 218.27,4.73 218.27,6.25 C29.2 | U30.6 229.13,4.37 v229.25,4.25 229.28,4.22 U$120.P$3 231.97,4.25 | U$119.P$3 225.6,4.22 225.62,4.25 226,4.25 226.25,4.5 | 226.25,4.5 226.5,4.75 v226.88,4.75 | 226.25,4.5 226.02,4.73 226.02,6.25 C30.2 | U31.6 236.88,4.37 v237,4.25 237.03,4.22 U$124.P$3 239.72,4.25 | U$123.P$3 233.35,4.22 233.38,4.25 233.75,4.25 234,4.5 | 234,4.5 234.25,4.75 v234.62,4.75 | 234,4.5 233.77,4.73 233.77,6.25 C31.2 | U32.6 244.63,4.37 v244.75,4.25 244.78,4.22 U$128.P$3 247.47,4.25 | U$127.P$3 241.1,4.22 241.12,4.25 241.5,4.25 241.75,4.5 | 241.75,4.5 242,4.75 v242.38,4.75 | 241.75,4.5 241.52,4.73 241.52,6.25 C32.2
  Top 0.254: U$7.P$3 U$4.P$3 | U$11.P$3 U$8.P$3 | U$15.P$3 U$12.P$3 | U$23.P$3 U$20.P$3 | U$27.P$3 U$24.P$3 | U$31.P$3 U$28.P$3 | U$39.P$3 U$36.P$3 | U$43.P$3 U$40.P$3 | U$47.P$3 U$44.P$3 | U$55.P$3 U$52.P$3 | U$59.P$3 U$56.P$3 | U$63.P$3 U$60.P$3 | U$35.P$3 U$32.P$3 | U$71.P$3 U$68.P$3 | U$75.P$3 U$72.P$3 | U$79.P$3 U$76.P$3 | U$87.P$3 U$84.P$3 | U$91.P$3 U$88.P$3 | U$95.P$3 U$92.P$3 | U$103.P$3 U$100.P$3 | U$107.P$3 U$104.P$3 | U$111.P$3 U$108.P$3 | U$119.P$3 U$116.P$3 | U$123.P$3 U$120.P$3 | U$127.P$3 U$124.P$3 | U$99.P$3 U$96.P$3 | U$67.P$3 U$64.P$3 | U$19.P$3 U$16.P$3 | U$48.P$3 U$51.P$3 93.85,4.22 | U$83.P$3 U$80.P$3 | U$115.P$3 U$112.P$3
  Bottom 0.2: v4.5,4.25 4.5,4 3.25,4 2.5,4.75 v2.12,4.75 | v12.25,4.25 12.25,4 11,4 10.25,4.75 v9.88,4.75 | v20,4.25 20,4 18.75,4 18,4.75 v17.62,4.75 | v27.75,4.25 27.75,4 26.5,4 25.75,4.75 v25.38,4.75 | v35.5,4.25 35.5,4 34.25,4 33.5,4.75 v33.12,4.75 | v43.25,4.25 43.25,4 42,4 41.25,4.75 v40.88,4.75 | v51,4.25 51,4 49.75,4 49,4.75 v48.62,4.75 | v58.75,4.25 58.75,4 57.5,4 56.75,4.75 v56.38,4.75 | v66.5,4.25 66.5,4 65.25,4 64.5,4.75 v64.12,4.75 | v74.25,4.25 74.25,4 73,4 72.25,4.75 v71.88,4.75 | v82,4.25 82,4 80.75,4 80,4.75 v79.62,4.75 | v89.75,4.25 89.75,4 88.5,4 87.75,4.75 v87.38,4.75 | v97.5,4.25 97.5,4 96.25,4 95.5,4.75 v95.12,4.75 | v105.25,4.25 105.25,4 104,4 103.25,4.75 v102.88,4.75 | v113,4.25 113,4 111.75,4 111,4.75 v110.62,4.75 | v120.75,4.25 120.75,4 119.5,4 118.75,4.75 v118.38,4.75 | v128.5,4.25 128.5,4 127.25,4 126.5,4.75 v126.12,4.75 | v136.25,4.25 136.25,4 135,4 134.25,4.75 v133.88,4.75 | v144,4.25 144,4 142.75,4 142,4.75 v141.62,4.75 | v151.75,4.25 151.75,4 150.5,4 149.75,4.75 v149.38,4.75 | v159.5,4.25 159.5,4 158.25,4 157.5,4.75 v157.12,4.75 | v167.25,4.25 167.25,4 166,4 165.25,4.75 v164.88,4.75 | v175,4.25 175,4 173.75,4 173,4.75 v172.62,4.75 | v182.75,4.25 182.75,4 181.5,4 180.75,4.75 v180.38,4.75 | v190.5,4.25 190.5,4 189.25,4 188.5,4.75 v188.12,4.75 | v198.25,4.25 198.25,4 197,4 196.25,4.75 v195.88,4.75 | v206,4.25 206,4 204.75,4 204,4.75 v203.62,4.75 | v213.75,4.25 213.75,4 212.5,4 211.75,4.75 v211.38,4.75 | v221.5,4.25 221.5,4 220.25,4 219.5,4.75 v219.12,4.75 | v229.25,4.25 229.25,4 228,4 227.25,4.75 v226.88,4.75 | v237,4.25 237,4 235.75,4 235,4.75 v234.62,4.75
  Bottom 0.2: v244.75,4.25 244.75,4 243.5,4 242.75,4.75 v242.38,4.75
N$1
  Top 0.2: 13.4,6.78 U2.5 13.38,6.5 13.38,7 13.62,7.25 13.99,7.25 R1.1
N$2
  Top 0.2: U2.4 13.68,1 R2.2
N$3
  Top 0.2: 9.6,6.78 U2.8 8.79,7.28 R3.1
N$4
  Top 0.2: 5.66,6.78 U1.5 5.62,6.5 5.62,7 5.88,7.25 6.25,7.25 R4.1
N$5
  Top 0.2: U1.4 5.93,1 R5.2
N$6
  Top 0.2: 1.84,6.78 U1.8 1.04,7.28 R6.1
N$7
  Top 0.2: 21.16,6.78 U3.5 21.12,6.5 21.12,7 21.38,7.25 21.75,7.25 R7.1
N$8
  Top 0.2: U3.4 21.43,1 R8.2
N$9
  Top 0.2: 17.34,6.78 U3.8 16.55,7.28 R9.1
N$10
  Top 0.2: 28.91,6.78 U4.5 28.88,6.5 28.88,7 29.12,7.25 29.5,7.25 R10.1
N$11
  Top 0.2: U4.4 29.18,1 R11.2
N$12
  Top 0.2: 25.09,6.78 U4.8 24.3,7.28 R12.1
N$13
  Top 0.2: 36.66,6.78 U5.5 36.62,6.5 36.62,7 36.88,7.25 37.24,7.25 R13.1
N$14
  Top 0.2: U5.4 36.93,1 R14.2
N$15
  Top 0.2: 32.84,6.78 U5.8 32.05,7.28 R15.1
N$16
  Top 0.2: 44.41,6.78 U6.5 44.38,6.5 44.38,7 44.62,7.25 44.99,7.25 R16.1
N$17
  Top 0.2: U6.4 44.68,1 R17.2
N$18
  Top 0.2: 40.59,6.78 U6.8 39.8,7.28 R18.1
N$19
  Top 0.2: 52.16,6.78 U7.5 52.12,6.5 52.12,7 52.38,7.25 52.74,7.25 R19.1
N$20
  Top 0.2: U7.4 52.43,1 R20.2
N$21
  Top 0.2: 48.34,6.78 U7.8 47.55,7.28 R21.1
N$22
  Top 0.2: 59.91,6.78 U8.5 59.88,6.5 59.88,7 60.12,7.25 60.49,7.25 R22.1
N$23
  Top 0.2: U8.4 60.18,1 R23.2
N$24
  Top 0.2: 56.09,6.78 U8.8 55.3,7.28 R24.1
N$25
  Top 0.2: 67.66,6.78 U9.5 67.62,6.5 67.62,7 67.88,7.25 68.25,7.25 R25.1
N$26
  Top 0.2: U9.4 67.93,1 R26.2
N$27
  Top 0.2: 63.84,6.78 U9.8 63.05,7.28 R27.1
N$28
  Top 0.2: 75.41,6.78 U10.5 75.38,6.5 75.38,7 75.62,7.25 76,7.25 R28.1
N$29
  Top 0.2: U10.4 75.68,1 R29.2
N$30
  Top 0.2: 71.59,6.78 U10.8 70.8,7.28 R30.1
N$31
  Top 0.2: 83.16,6.78 U11.5 83.12,6.5 83.12,7 83.38,7.25 83.75,7.25 R31.1
N$32
  Top 0.2: U11.4 83.43,1 R32.2
N$33
  Top 0.2: 79.34,6.78 U11.8 78.55,7.28 R33.1
N$34
  Top 0.2: 90.91,6.78 U12.5 90.88,6.5 90.88,7 91.12,7.25 91.5,7.25 R34.1
N$35
  Top 0.2: U12.4 91.18,1 R35.2
N$36
  Top 0.2: 87.09,6.78 U12.8 86.3,7.28 R36.1
N$37
  Top 0.2: 98.66,6.78 U13.5 98.62,6.5 98.62,7 98.88,7.25 99.25,7.25 R37.1
N$38
  Top 0.2: U13.4 98.93,1 R38.2
N$39
  Top 0.2: 94.84,6.78 U13.8 94.05,7.28 R39.1
N$40
  Top 0.2: 106.41,6.78 U14.5 106.38,6.5 106.38,7 106.62,7.25 107,7.25 R40.1
N$41
  Top 0.2: U14.4 106.68,1 R41.2
N$42
  Top 0.2: 102.59,6.78 U14.8 101.8,7.28 R42.1
N$43
  Top 0.2: 114.16,6.78 U15.5 114.12,6.5 114.12,7 114.38,7.25 114.75,7.25 R43.1
N$44
  Top 0.2: U15.4 114.43,1 R44.2
N$45
  Top 0.2: 110.34,6.78 U15.8 109.55,7.28 R45.1
N$46
  Top 0.2: 121.91,6.78 U16.5 121.88,6.5 121.88,7 122.12,7.25 122.5,7.25 R46.1
N$47
  Top 0.2: U16.4 122.18,1 R47.2
N$48
  Top 0.2: 118.09,6.78 U16.8 117.3,7.28 R48.1
N$49
  Top 0.2: 129.66,6.78 U17.5 129.62,6.5 129.62,7 129.88,7.25 130.25,7.25 R49.1
N$50
  Top 0.2: U17.4 129.93,1 R50.2
N$51
  Top 0.2: 125.84,6.78 U17.8 125.05,7.28 R51.1
N$52
  Top 0.2: 137.41,6.78 U18.5 137.38,6.5 137.38,7 137.62,7.25 138,7.25 R52.1
N$53
  Top 0.2: U18.4 137.68,1 R53.2
N$54
  Top 0.2: 133.59,6.78 U18.8 132.79,7.28 R54.1
N$55
  Top 0.2: 145.16,6.78 U19.5 145.12,6.5 145.12,7 145.38,7.25 145.75,7.25 R55.1
N$56
  Top 0.2: U19.4 145.43,1 R56.2
N$57
  Top 0.2: 141.34,6.78 U19.8 140.54,7.28 R57.1
N$58
  Top 0.2: 152.91,6.78 U20.5 152.88,6.5 152.88,7 153.12,7.25 153.5,7.25 R58.1
N$59
  Top 0.2: U20.4 153.18,1 R59.2
N$60
  Top 0.2: 149.09,6.78 U20.8 148.29,7.28 R60.1
N$61
  Top 0.2: 160.66,6.78 U21.5 160.62,6.5 160.62,7 160.88,7.25 161.25,7.25 R61.1
N$62
  Top 0.2: U21.4 160.93,1 R62.2
N$63
  Top 0.2: 156.84,6.78 U21.8 156.04,7.28 R63.1
N$64
  Top 0.2: 168.41,6.78 U22.5 168.38,6.5 168.38,7 168.62,7.25 169,7.25 R64.1
N$65
  Top 0.2: U22.4 168.68,1 R65.2
N$66
  Top 0.2: 164.59,6.78 U22.8 163.79,7.28 R66.1
N$67
  Top 0.2: 176.16,6.78 U23.5 176.12,6.5 176.12,7 176.38,7.25 176.75,7.25 R67.1
N$68
  Top 0.2: U23.4 176.43,1 R68.2
N$69
  Top 0.2: 172.34,6.78 U23.8 171.54,7.28 R69.1
N$70
  Top 0.2: 183.91,6.78 U24.5 183.88,6.5 183.88,7 184.12,7.25 184.5,7.25 R70.1
N$71
  Top 0.2: U24.4 184.18,1 R71.2
N$72
  Top 0.2: 180.09,6.78 U24.8 179.29,7.28 R72.1
N$73
  Top 0.2: 191.66,6.78 U25.5 191.62,6.5 191.62,7 191.88,7.25 192.25,7.25 R73.1
N$74
  Top 0.2: U25.4 191.93,1 R74.2
N$75
  Top 0.2: 187.84,6.78 U25.8 187.04,7.28 R75.1
N$76
  Top 0.2: 199.41,6.78 U26.5 199.38,6.5 199.38,7 199.62,7.25 200,7.25 R76.1
N$77
  Top 0.2: U26.4 199.68,1 R77.2
N$78
  Top 0.2: 195.59,6.78 U26.8 194.79,7.28 R78.1
N$79
  Top 0.2: 207.16,6.78 U27.5 207.12,6.5 207.12,7 207.38,7.25 207.75,7.25 R79.1
N$80
  Top 0.2: U27.4 207.43,1 R80.2
N$81
  Top 0.2: 203.34,6.78 U27.8 202.54,7.28 R81.1
N$82
  Top 0.2: 214.91,6.78 U28.5 214.88,6.5 214.88,7 215.12,7.25 215.5,7.25 R82.1
N$83
  Top 0.2: U28.4 215.18,1 R83.2
N$84
  Top 0.2: 211.09,6.78 U28.8 210.29,7.28 R84.1
N$85
  Top 0.2: 222.66,6.78 U29.5 222.62,6.5 222.62,7 222.88,7.25 223.25,7.25 R85.1
N$86
  Top 0.2: U29.4 222.93,1 R86.2
N$87
  Top 0.2: 218.84,6.78 U29.8 218.04,7.28 R87.1
N$88
  Top 0.2: 230.41,6.78 U30.5 230.38,6.5 230.38,7 230.62,7.25 231,7.25 R88.1
N$89
  Top 0.2: U30.4 230.68,1 R89.2
N$90
  Top 0.2: 226.59,6.78 U30.8 225.79,7.28 R90.1
N$91
  Top 0.2: 238.16,6.78 U31.5 238.12,6.5 238.12,7 238.38,7.25 238.75,7.25 R91.1
N$92
  Top 0.2: U31.4 238.43,1 R92.2
N$93
  Top 0.2: 234.34,6.78 U31.8 233.54,7.28 R93.1
N$94
  Top 0.2: 245.91,6.78 U32.5 245.88,6.5 245.88,7 246.12,7.25 246.5,7.25 R94.1
N$95
  Top 0.2: U32.4 246.18,1 R95.2
N$96
  Top 0.2: 242.09,6.78 U32.8 241.29,7.28 R96.1
NEG_PAD0  (via drill 0.3)
  Top 0.2: U1.1 U1.2 U1.3 4.75,1.64 v4.75,2.75
  Bottom 0.2: v4.75,2.75 5.12,2.38 U$1.P$1
NEG_PAD1  (via drill 0.3)
  Top 0.2: U2.1 U2.2 U2.3 12.5,1.64 v12.5,2.75
  Bottom 0.2: v12.5,2.75 12.87,2.38 U$5.P$1
NEG_PAD2  (via drill 0.3)
  Top 0.2: U3.1 U3.2 U3.3 20.25,1.64 v20.25,2.75
  Bottom 0.2: v20.25,2.75 20.61,2.38 U$9.P$1
NEG_PAD3  (via drill 0.3)
  Top 0.2: U4.1 U4.2 U4.3 28,1.64 v28,2.75
  Bottom 0.2: v28,2.75 28.36,2.38 U$13.P$1
NEG_PAD4  (via drill 0.3)
  Top 0.2: U5.1 U5.2 U5.3 35.75,1.64 v35.75,2.75
  Bottom 0.2: v35.75,2.75 36.12,2.38 U$17.P$1
NEG_PAD5  (via drill 0.3)
  Top 0.2: U6.1 U6.2 U6.3 43.5,1.64 v43.5,2.75
  Bottom 0.2: v43.5,2.75 43.87,2.38 U$21.P$1
NEG_PAD6  (via drill 0.3)
  Top 0.2: U7.1 U7.2 U7.3 51.25,1.64 v51.25,2.75
  Bottom 0.2: v51.25,2.75 51.62,2.38 U$25.P$1
NEG_PAD7  (via drill 0.3)
  Top 0.2: U8.1 U8.2 U8.3 59,1.64 v59,2.75
  Bottom 0.2: v59,2.75 59.37,2.38 U$29.P$1
NEG_PAD8  (via drill 0.3)
  Top 0.2: U9.1 U9.2 U9.3 66.75,1.64 v66.75,2.75
  Bottom 0.2: v66.75,2.75 67.11,2.38 U$33.P$1
NEG_PAD9  (via drill 0.3)
  Top 0.2: U10.1 U10.2 U10.3 74.5,1.64 v74.5,2.75
  Bottom 0.2: v74.5,2.75 74.86,2.38 U$37.P$1
NEG_PAD10  (via drill 0.3)
  Top 0.2: U11.1 U11.2 U11.3 82.25,1.64 v82.25,2.75
  Bottom 0.2: v82.25,2.75 82.61,2.38 U$41.P$1
NEG_PAD11  (via drill 0.3)
  Top 0.2: U12.1 U12.2 U12.3 90,1.64 v90,2.75
  Bottom 0.2: v90,2.75 90.36,2.38 U$45.P$1
NEG_PAD12  (via drill 0.3)
  Top 0.2: U13.1 U13.2 U13.3 97.75,1.64 v97.75,2.75
  Bottom 0.2: v97.75,2.75 98.11,2.38 U$49.P$1
NEG_PAD13  (via drill 0.3)
  Top 0.2: U14.1 U14.2 U14.3 105.5,1.64 v105.5,2.75
  Bottom 0.2: v105.5,2.75 105.86,2.38 U$53.P$1
NEG_PAD14  (via drill 0.3)
  Top 0.2: U15.1 U15.2 U15.3 113.25,1.64 v113.25,2.75
  Bottom 0.2: v113.25,2.75 113.61,2.38 U$57.P$1
NEG_PAD15  (via drill 0.3)
  Top 0.2: U16.1 U16.2 U16.3 121,1.64 v121,2.75
  Bottom 0.2: v121,2.75 121.36,2.38 U$61.P$1
NEG_PAD16  (via drill 0.3)
  Top 0.2: U17.1 U17.2 U17.3 128.75,1.64 v128.75,2.75
  Bottom 0.2: v128.75,2.75 129.12,2.38 U$65.P$1
NEG_PAD17  (via drill 0.3)
  Top 0.2: U18.1 U18.2 U18.3 136.5,1.64 v136.5,2.75
  Bottom 0.2: v136.5,2.75 136.87,2.38 U$69.P$1
NEG_PAD18  (via drill 0.3)
  Top 0.2: U19.1 U19.2 U19.3 144.25,1.64 v144.25,2.75
  Bottom 0.2: v144.25,2.75 144.62,2.38 U$73.P$1
NEG_PAD19  (via drill 0.3)
  Top 0.2: U20.1 U20.2 U20.3 152,1.64 v152,2.75
  Bottom 0.2: v152,2.75 152.37,2.38 U$77.P$1
NEG_PAD20  (via drill 0.3)
  Top 0.2: U21.1 U21.2 U21.3 159.75,1.64 v159.75,2.75
  Bottom 0.2: v159.75,2.75 160.12,2.38 U$81.P$1
NEG_PAD21  (via drill 0.3)
  Top 0.2: U22.1 U22.2 U22.3 167.5,1.64 v167.5,2.75
  Bottom 0.2: v167.5,2.75 167.87,2.38 U$85.P$1
NEG_PAD22  (via drill 0.3)
  Top 0.2: U23.1 U23.2 U23.3 175.25,1.64 v175.25,2.75
  Bottom 0.2: v175.25,2.75 175.62,2.38 U$89.P$1
NEG_PAD23  (via drill 0.3)
  Top 0.2: U24.1 U24.2 U24.3 183,1.64 v183,2.75
  Bottom 0.2: v183,2.75 183.37,2.38 U$93.P$1
NEG_PAD24  (via drill 0.3)
  Top 0.2: U25.1 U25.2 U25.3 190.75,1.64 v190.75,2.75
  Bottom 0.2: v190.75,2.75 191.12,2.38 U$97.P$1
NEG_PAD25  (via drill 0.3)
  Top 0.2: U26.1 U26.2 U26.3 198.5,1.64 v198.5,2.75
  Bottom 0.2: v198.5,2.75 198.87,2.38 U$101.P$1
NEG_PAD26  (via drill 0.3)
  Top 0.2: U27.1 U27.2 U27.3 206.25,1.64 v206.25,2.75
  Bottom 0.2: v206.25,2.75 206.62,2.38 U$105.P$1
NEG_PAD27  (via drill 0.3)
  Top 0.2: U28.1 U28.2 U28.3 214,1.64 v214,2.75
  Bottom 0.2: v214,2.75 214.37,2.38 U$109.P$1
NEG_PAD28  (via drill 0.3)
  Top 0.2: U29.1 U29.2 U29.3 221.75,1.64 v221.75,2.75
  Bottom 0.2: v221.75,2.75 222.12,2.38 U$113.P$1
NEG_PAD29  (via drill 0.3)
  Top 0.2: U30.1 U30.2 U30.3 229.5,1.64 v229.5,2.75
  Bottom 0.2: v229.5,2.75 229.87,2.38 U$117.P$1
NEG_PAD30  (via drill 0.3)
  Top 0.2: U31.1 U31.2 U31.3 237.25,1.64 v237.25,2.75
  Bottom 0.2: v237.25,2.75 237.62,2.38 U$121.P$1
NEG_PAD31  (via drill 0.3)
  Top 0.2: U32.1 U32.2 U32.3 245,1.64 v245,2.75
  Bottom 0.2: v245,2.75 245.37,2.38 U$125.P$1
VCC  (via drill 0.3)
  Top 0.2: v5.25,4.88 6.25,4.88 6.5,5.12 U$4.P$4 | U$3.P$4 0.47,5.15 v0.47,5.75 C2.1 0.47,6.66 R6.2 | v13,4.88 14,4.88 14.25,5.12 U$8.P$4 | U$7.P$4 8.22,5.15 v8.22,5.75 C1.1 8.22,6.66 R3.2 | v20.75,4.88 21.75,4.88 22,5.12 U$12.P$4 | U$11.P$4 15.97,5.15 v15.97,5.75 C3.1 15.97,6.66 R9.2 | v28.5,4.88 29.5,4.88 29.75,5.12 U$16.P$4 | U$15.P$4 23.73,5.15 v23.73,5.75 C4.1 23.72,6.66 R12.2 | v36.25,4.88 37.25,4.88 37.5,5.12 U$20.P$4 | U$19.P$4 31.48,5.15 v31.48,5.75 C5.1 31.47,6.66 R15.2 | v44,4.88 45,4.88 45.25,5.12 U$24.P$4 | U$23.P$4 39.23,5.15 v39.23,5.75 C6.1 39.22,6.66 R18.2 | v51.75,4.88 52.75,4.88 53,5.12 U$28.P$4 | U$27.P$4 46.98,5.15 v46.98,5.75 C7.1 46.97,6.66 R21.2 | v59.5,4.88 60.5,4.88 60.75,5.12 U$32.P$4 | U$31.P$4 54.73,5.15 v54.73,5.75 C8.1 54.72,6.66 R24.2 | v67.25,4.88 68.25,4.88 68.5,5.12 U$36.P$4 | U$35.P$4 62.48,5.15 v62.48,5.75 C9.1 62.47,6.66 R27.2 | v75,4.88 76,4.88 76.25,5.12 U$40.P$4 | U$39.P$4 70.22,5.15 v70.22,5.75 C10.1 70.22,6.66 R30.2 | v82.75,4.88 83.75,4.88 84,5.12 U$44.P$4 | U$43.P$4 77.97,5.15 v77.97,5.75 C11.1 77.97,6.66 R33.2 | v90.5,4.88 91.5,4.88 91.75,5.12 U$48.P$4 | U$47.P$4 85.72,5.15 v85.72,5.75 C12.1 85.72,6.66 R36.2 | v98.25,4.88 99.25,4.88 99.5,5.12 U$52.P$4 | U$51.P$4 93.47,5.15 v93.47,5.75 C13.1 93.47,6.66 R39.2 | v106,4.88 107,4.88 107.25,5.12 U$56.P$4 | U$55.P$4 101.22,5.15 v101.22,5.75 C14.1 101.22,6.66 R42.2 | v113.75,4.88 114.75,4.88 115,5.12 U$60.P$4 | U$59.P$4 108.97,5.15 v108.97,5.75 C15.1 108.97,6.66 R45.2 | v121.5,4.88 122.5,4.88 122.75,5.12 U$64.P$4 | U$63.P$4 116.72,5.15 v116.72,5.75 C16.1 116.72,6.66 R48.2 | v129.25,4.88 130.25,4.88 130.5,5.12 U$68.P$4
  Top 0.2: U$67.P$4 124.47,5.15 v124.47,5.75 C17.1 124.47,6.66 R51.2 | v137,4.88 138,4.88 138.25,5.12 U$72.P$4 | U$71.P$4 132.22,5.15 v132.22,5.75 C18.1 132.22,6.66 R54.2 | v144.75,4.88 145.75,4.88 146,5.12 U$76.P$4 | U$75.P$4 139.97,5.15 v139.97,5.75 C19.1 139.97,6.66 R57.2 | v152.5,4.88 153.5,4.88 153.75,5.12 U$80.P$4 | U$79.P$4 147.72,5.15 v147.72,5.75 C20.1 147.72,6.66 R60.2 | v160.25,4.88 161.25,4.88 161.5,5.12 U$84.P$4 | U$83.P$4 155.47,5.15 v155.47,5.75 C21.1 155.47,6.66 R63.2 | v168,4.88 169,4.88 169.25,5.12 U$88.P$4 | U$87.P$4 163.22,5.15 v163.22,5.75 C22.1 163.22,6.66 R66.2 | v175.75,4.88 176.75,4.88 177,5.12 U$92.P$4 | U$91.P$4 170.97,5.15 v170.97,5.75 C23.1 170.97,6.66 R69.2 | v183.5,4.88 184.5,4.88 184.75,5.12 U$96.P$4 | U$95.P$4 178.72,5.15 v178.72,5.75 C24.1 178.72,6.66 R72.2 | v191.25,4.88 192.25,4.88 192.5,5.12 U$100.P$4 | U$99.P$4 186.47,5.15 v186.47,5.75 C25.1 186.47,6.66 R75.2 | v199,4.88 200,4.88 200.25,5.12 U$104.P$4 | U$103.P$4 194.22,5.15 v194.22,5.75 C26.1 194.22,6.66 R78.2 | v206.75,4.88 207.75,4.88 208,5.12 U$108.P$4 | U$107.P$4 201.97,5.15 v201.97,5.75 C27.1 201.97,6.66 R81.2 | v214.5,4.88 215.5,4.88 215.75,5.12 U$112.P$4 | U$111.P$4 209.72,5.15 v209.72,5.75 C28.1 209.72,6.66 R84.2 | v222.25,4.88 223.25,4.88 223.5,5.12 U$116.P$4 | U$115.P$4 217.47,5.15 v217.47,5.75 C29.1 217.47,6.66 R87.2 | v230,4.88 231,4.88 231.25,5.12 U$120.P$4 | U$119.P$4 225.22,5.15 v225.22,5.75 C30.1 225.22,6.66 R90.2 | v237.75,4.88 238.75,4.88 239,5.12 U$124.P$4 | U$123.P$4 232.97,5.15 v232.97,5.75 C31.1 232.97,6.66 R93.2 | v245.5,4.88 246.5,4.88 246.75,5.12 U$128.P$4 | U$127.P$4 240.72,5.15 v240.72,5.75 C32.1 240.72,6.66 R96.2
  Top 0.254: U$4.P$4 8.22,5.12 R3.2 | 15.97,5.15 15,5.15 U$8.P$4 | 23.73,5.15 22.77,5.15 U$12.P$4 | U$20.P$4 39.22,5.12 R18.2 | 46.98,5.15 46,5.15 U$24.P$4 | 54.73,5.15 53.77,5.15 U$28.P$4 | U$16.P$4 31.47,5.12 R15.2 | U$36.P$4 70.22,5.12 R30.2 | 77.97,5.15 77,5.15 U$40.P$4 | 85.72,5.15 84.78,5.15 U$44.P$4 | U$52.P$4 101.22,5.12 R42.2 | 108.97,5.15 108,5.15 U$56.P$4 | 116.72,5.15 115.78,5.15 U$60.P$4 | U$48.P$4 93.47,5.12 R39.2 | U$32.P$4 62.47,5.12 R27.2 | U$68.P$4 132.22,5.12 R54.2 | 139.97,5.15 139,5.15 U$72.P$4 | 147.72,5.15 146.78,5.15 U$76.P$4 | U$84.P$4 163.22,5.12 R66.2 | 170.97,5.15 170,5.15 U$88.P$4 | 178.72,5.15 177.78,5.15 U$92.P$4 | U$80.P$4 155.47,5.12 R63.2 | U$100.P$4 194.22,5.12 R78.2 | 201.97,5.15 201,5.15 U$104.P$4 | 209.72,5.15 208.78,5.15 U$108.P$4 | U$116.P$4 225.22,5.12 R90.2 | 232.97,5.15 232,5.15 U$120.P$4 | 240.72,5.15 239.78,5.15 U$124.P$4 | U$112.P$4 217.47,5.12 R87.2 | U$96.P$4 186.47,5.12 R75.2 | 124.47,5.15 123.53,5.15 U$64.P$4
  Bottom 0.2: v5.25,4.88 5.25,3.75 5,3.5 3,3.5 1.67,2.17 | v0.47,5.75 0.47,3.36 1.67,2.17 | 1.67,2.17 2.51,1.32 U$1.P$2 | v13,4.88 13,3.75 12.75,3.5 10.75,3.5 9.42,2.17 | v8.22,5.75 8.22,3.36 9.42,2.17 | 9.42,2.17 10.26,1.32 U$5.P$2 | v20.75,4.88 20.75,3.75 20.5,3.5 18.5,3.5 17.17,2.17 | v15.97,5.75 15.97,3.36 17.17,2.17 | 17.17,2.17 18.01,1.32 U$9.P$2 | v28.5,4.88 28.5,3.75 28.25,3.5 26.25,3.5 24.92,2.17 | v23.73,5.75 23.73,3.36 24.92,2.17 | 24.92,2.17 25.76,1.32 U$13.P$2 | v36.25,4.88 36.25,3.75 36,3.5 34,3.5 32.67,2.17 | v31.48,5.75 31.48,3.36 32.67,2.17 | 32.67,2.17 33.51,1.32 U$17.P$2 | v44,4.88 44,3.75 43.75,3.5 41.75,3.5 40.42,2.17 | v39.23,5.75 39.23,3.36 40.42,2.17 | 40.42,2.17 41.26,1.32 U$21.P$2 | v51.75,4.88 51.75,3.75 51.5,3.5 49.5,3.5 48.17,2.17 | v46.98,5.75 46.98,3.36 48.17,2.17 | 48.17,2.17 49.01,1.32 U$25.P$2 | v59.5,4.88 59.5,3.75 59.25,3.5 57.25,3.5 55.92,2.17 | v54.73,5.75 54.73,3.36 55.92,2.17 | 55.92,2.17 56.76,1.32 U$29.P$2 | v67.25,4.88 67.25,3.75 67,3.5 65,3.5 63.67,2.17 | v62.48,5.75 62.48,3.36 63.67,2.17 | 63.67,2.17 64.51,1.32 U$33.P$2 | v75,4.88 75,3.75 74.75,3.5 72.75,3.5 71.42,2.17 | v70.22,5.75 70.22,3.36 71.42,2.17 | 71.42,2.17 72.26,1.32 U$37.P$2 | v82.75,4.88 82.75,3.75 82.5,3.5 80.5,3.5 79.17,2.17 | v77.97,5.75 77.97,3.36 79.17,2.17 | 79.17,2.17 80.01,1.32 U$41.P$2 | v90.5,4.88 90.5,3.75 90.25,3.5 88.25,3.5 86.92,2.17 | v85.72,5.75 85.72,3.36 86.92,2.17 | 86.92,2.17 87.76,1.32 U$45.P$2 | v98.25,4.88 98.25,3.75 98,3.5 96,3.5 94.67,2.17 | v93.47,5.75 93.47,3.36 94.67,2.17 | 94.67,2.17 95.51,1.32 U$49.P$2 | v106,4.88 106,3.75 105.75,3.5 103.75,3.5 102.42,2.17 | v101.22,5.75 101.22,3.36 102.42,2.17
  Bottom 0.2: 102.42,2.17 103.26,1.32 U$53.P$2 | v113.75,4.88 113.75,3.75 113.5,3.5 111.5,3.5 110.17,2.17 | v108.97,5.75 108.97,3.36 110.17,2.17 | 110.17,2.17 111.01,1.32 U$57.P$2 | v121.5,4.88 121.5,3.75 121.25,3.5 119.25,3.5 117.92,2.17 | v116.72,5.75 116.72,3.36 117.92,2.17 | 117.92,2.17 118.76,1.32 U$61.P$2 | v129.25,4.88 129.25,3.75 129,3.5 127,3.5 125.67,2.17 | v124.47,5.75 124.47,3.36 125.67,2.17 | 125.67,2.17 126.51,1.32 U$65.P$2 | v137,4.88 137,3.75 136.75,3.5 134.75,3.5 133.42,2.17 | v132.22,5.75 132.22,3.36 133.42,2.17 | 133.42,2.17 134.26,1.32 U$69.P$2 | v144.75,4.88 144.75,3.75 144.5,3.5 142.5,3.5 141.17,2.17 | v139.97,5.75 139.97,3.36 141.17,2.17 | 141.17,2.17 142.01,1.32 U$73.P$2 | v152.5,4.88 152.5,3.75 152.25,3.5 150.25,3.5 148.92,2.17 | v147.72,5.75 147.72,3.36 148.92,2.17 | 148.92,2.17 149.76,1.32 U$77.P$2 | v160.25,4.88 160.25,3.75 160,3.5 158,3.5 156.67,2.17 | v155.47,5.75 155.47,3.36 156.67,2.17 | 156.67,2.17 157.51,1.32 U$81.P$2 | v168,4.88 168,3.75 167.75,3.5 165.75,3.5 164.42,2.17 | v163.22,5.75 163.22,3.36 164.42,2.17 | 164.42,2.17 165.26,1.32 U$85.P$2 | v175.75,4.88 175.75,3.75 175.5,3.5 173.5,3.5 172.17,2.17 | v170.97,5.75 170.97,3.36 172.17,2.17 | 172.17,2.17 173.01,1.32 U$89.P$2 | v183.5,4.88 183.5,3.75 183.25,3.5 181.25,3.5 179.92,2.17 | v178.72,5.75 178.72,3.36 179.92,2.17 | 179.92,2.17 180.76,1.32 U$93.P$2 | v191.25,4.88 191.25,3.75 191,3.5 189,3.5 187.67,2.17 | v186.47,5.75 186.47,3.36 187.67,2.17 | 187.67,2.17 188.51,1.32 U$97.P$2 | v199,4.88 199,3.75 198.75,3.5 196.75,3.5 195.42,2.17 | v194.22,5.75 194.22,3.36 195.42,2.17 | 195.42,2.17 196.26,1.32 U$101.P$2 | v206.75,4.88 206.75,3.75 206.5,3.5 204.5,3.5 203.17,2.17
  Bottom 0.2: v201.97,5.75 201.97,3.36 203.17,2.17 | 203.17,2.17 204.01,1.32 U$105.P$2 | v214.5,4.88 214.5,3.75 214.25,3.5 212.25,3.5 210.92,2.17 | v209.72,5.75 209.72,3.36 210.92,2.17 | 210.92,2.17 211.76,1.32 U$109.P$2 | v222.25,4.88 222.25,3.75 222,3.5 220,3.5 218.67,2.17 | v217.47,5.75 217.47,3.36 218.67,2.17 | 218.67,2.17 219.51,1.32 U$113.P$2 | v230,4.88 230,3.75 229.75,3.5 227.75,3.5 226.42,2.17 | v225.22,5.75 225.22,3.36 226.42,2.17 | 226.42,2.17 227.26,1.32 U$117.P$2 | v237.75,4.88 237.75,3.75 237.5,3.5 235.5,3.5 234.17,2.17 | v232.97,5.75 232.97,3.36 234.17,2.17 | 234.17,2.17 235.01,1.32 U$121.P$2 | v245.5,4.88 245.5,3.75 245.25,3.5 243.25,3.5 241.92,2.17 | v240.72,5.75 240.72,3.36 241.92,2.17 | 241.92,2.17 242.76,1.32 U$125.P$2